# Altium schematic sheet 06-MAC.SchDoc
size 420 x 297 mm; Customer: 01910
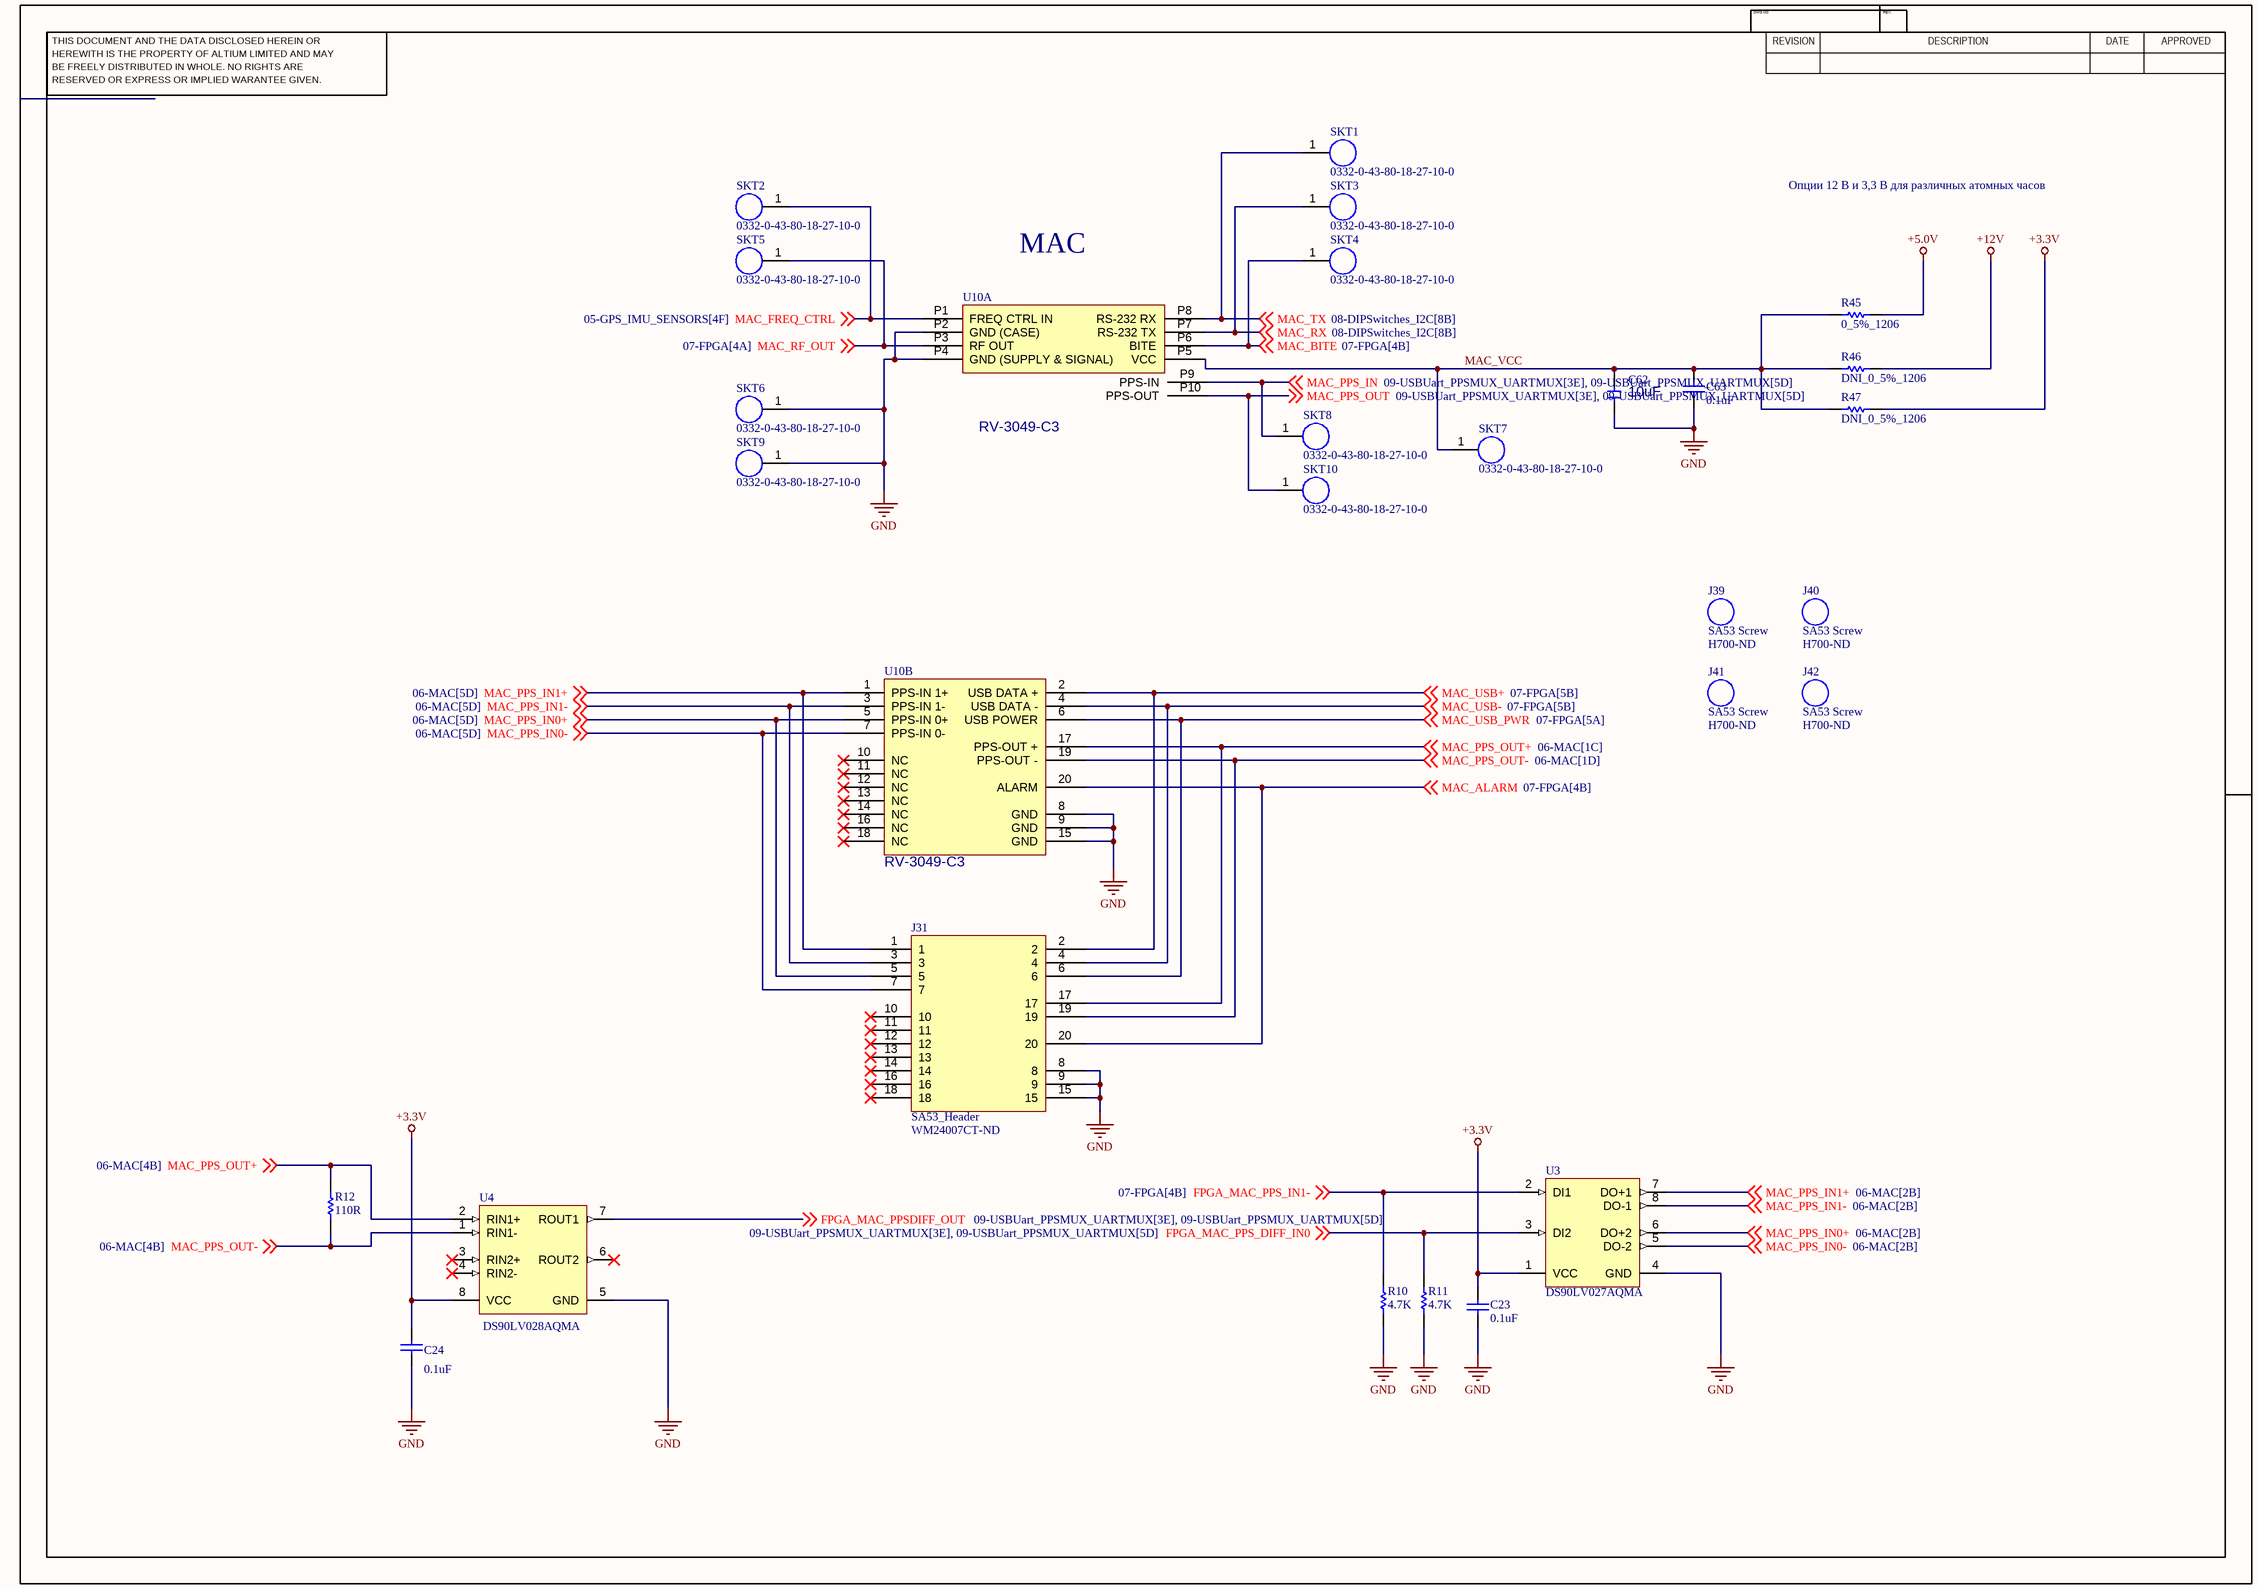
[diagram p0: 06-MAC.SchDoc]

## Parts
C23  0.1uF  [CAPC1608X87X45ML20T05]
C24  0.1uF  [CAPC1608X87X45ML20T05]
C62  value 10uF  [CAPC2012X14N]  (hidden comment: CAP_0805_10UF_25V)
C63  0.1uF  [CAPC1608X87X45ML20T05]
J31  SA53_Header  Supplier Part Number 1: WM24007CT-ND  [SA53_Header]
J39  SA53 Screw  Supplier Part Number 1: H700-ND
J40  SA53 Screw  Supplier Part Number 1: H700-ND
J41  SA53 Screw  Supplier Part Number 1: H700-ND
J42  SA53 Screw  Supplier Part Number 1: H700-ND
R10  4.7K  [RESC1608X55X25LL10T15]
R11  4.7K  [RESC1608X55X25LL10T15]
R12  110R  [RESC1609X50X30NL10T20]
R45  0_5%_1206  [RESC3116X65X50ML20T20]
R46  DNI_0_5%_1206  [RESC3116X65X50ML20T20]  (no BOM)
R47  DNI_0_5%_1206  [RESC3116X65X50ML20T20]  (no BOM)
SKT1  0332-0-43-80-18-27-10-0  [SolderSocket]
SKT2  0332-0-43-80-18-27-10-0  [SolderSocket]
SKT3  0332-0-43-80-18-27-10-0  [SolderSocket]
SKT4  0332-0-43-80-18-27-10-0  [SolderSocket]
SKT5  0332-0-43-80-18-27-10-0  [SolderSocket]
SKT6  0332-0-43-80-18-27-10-0  [SolderSocket]
SKT7  0332-0-43-80-18-27-10-0  [SolderSocket]
SKT8  0332-0-43-80-18-27-10-0  [SolderSocket]
SKT9  0332-0-43-80-18-27-10-0  [SolderSocket]
SKT10  0332-0-43-80-18-27-10-0  [SolderSocket]
U3  DS90LV027AQMA  [M08A_N]
U4  DS90LV028AQMA  [M08A_L]
U10  value RV-3049-C3  [SA53]  (hidden comment: MAC-SA5X)  (parts A,B of 2)

## Nets
+3.3V: C23.2 C24.1 R47.2 U3.1(VCC) U4.8(VCC)
+5.0V: R45.2
+12V: R46.2
GND: C23.1 C24.2 C62.2 C63.1 J31.8 J31.9 J31.15 R10.1 R11.1 SKT6.1 SKT9.1 U3.4(GND) U4.5(GND) U10.8(GND) U10.9(GND) U10.15(GND) U10.P2(GND_(CASE)) U10.P4(GND_(SUPPLY_&_SIGNAL))
FPGA_MAC_PPS_DIFF_IN0: R11.2 U3.3(DI2) ; off-sheet FPGA_MAC_PPS_DIFF_IN0
FPGA_MAC_PPS_IN1-: R10.2 U3.2(DI1) ; off-sheet FPGA_MAC_PPS_IN1-
FPGA_MAC_PPSDIFF_OUT: U4.7(ROUT1) ; off-sheet FPGA_MAC_PPSDIFF_OUT
MAC_ALARM: J31.20 U10.20(ALARM) ; off-sheet MAC_ALARM
MAC_BITE: SKT4.1 U10.P6(BITE) ; off-sheet MAC_BITE
MAC_FREQ_CTRL: SKT2.1 U10.P1(FREQ_CTRL_IN) ; off-sheet MAC_FREQ_CTRL
MAC_PPS_IN: SKT8.1 U10.P9(PPS-IN) ; off-sheet MAC_PPS_IN
MAC_PPS_IN0+: J31.5 U3.6(DO+2) U10.5(PPS-IN_0+) ; off-sheet MAC_PPS_IN0+
MAC_PPS_IN0-: J31.7 U3.5(DO-2) U10.7(PPS-IN_0-) ; off-sheet MAC_PPS_IN0-
MAC_PPS_IN1+: J31.1 U3.7(DO+1) U10.1(PPS-IN_1+) ; off-sheet MAC_PPS_IN1+
MAC_PPS_IN1-: J31.3 U3.8(DO-1) U10.3(PPS-IN_1-) ; off-sheet MAC_PPS_IN1-
MAC_PPS_OUT: SKT10.1 U10.P10(PPS-OUT) ; off-sheet MAC_PPS_OUT
MAC_PPS_OUT+: J31.17 R12.2 U4.2(RIN1+) U10.17(PPS-OUT_+) ; off-sheet MAC_PPS_OUT+
MAC_PPS_OUT-: J31.19 R12.1 U4.1(RIN1-) U10.19(PPS-OUT_-) ; off-sheet MAC_PPS_OUT-
MAC_RF_OUT: SKT5.1 U10.P3(RF_OUT) ; off-sheet MAC_RF_OUT
MAC_RX: SKT3.1 U10.P7(RS-232_TX) ; off-sheet MAC_RX
MAC_TX: SKT1.1 U10.P8(RS-232_RX) ; off-sheet MAC_TX
MAC_USB+: J31.2 U10.2(USB_DATA_+) ; off-sheet MAC_USB+
MAC_USB-: J31.4 U10.4(USB_DATA_-) ; off-sheet MAC_USB-
MAC_USB_PWR: J31.6 U10.6(USB_POWER) ; off-sheet MAC_USB_PWR
MAC_VCC: C62.1 C63.2 R45.1 R46.1 R47.1 SKT7.1 U10.P5(VCC)

Not connected (* = marked no-connect by the designer): J31 10* 11* 12* 13* 14* 16* 18*; U4 3(RIN2+)* 4(RIN2-)* 6(ROUT2)*; U10 10(NC)* 11(NC)* 12(NC)* 13(NC)* 14(NC)* 16(NC)* 18(NC)*

## Notes on the sheet
- Опции 12 В и 3,3 В для различных атомных часов
- MAC
- THIS DOCUMENT AND THE DATA DISCLOSED HEREIN OR
- HEREWITH IS THE PROPERTY OF ALTIUM LIMITED AND MAY
- DWG NO:
- REVISION
- REV:
- DESCRIPTION
- DATE
- APPROVED
- BE FREELY DISTRIBUTED IN WHOLE. NO RIGHTS ARE
- RESERVED OR EXPRESS OR IMPLIED WARANTEE GIVEN.

## Library data of the parts
C23 C24 C63 = CMP-2006-00003-1: C0603X104K5RACAUTO; Manufacturer: Kemet; Part Number: C0603X104K5RACAUTO
C62 = CAP_0805_10UF_25V: CAP, CER, 10.UF, 25V, 10%, X5R, 0805; MFG PART NUM: TMK212BBJ106KG-T; VALENTIUM PART NUM: <VALENTIUM>; MFG NAME: TAIYO YUDEN; MAXTEMP: 85C; MINTEMP: -55C; DESC: CAP, CER, 10.UF, 10V, 10%, X5R, 0805; MODIFY DATE: 10/23/2013; CATEGORY: CAP, CER; Date: 4/11/2006 3:37:28 PM; SHEETPART: *; P1: 10%; P2: 25V; P3: X5R; Size: 0805; Supplier 1: MOUSER; Supplier Part Number 1: 963-TMK212BBJ106KG-T
R10 R11 = CMP-2000-06942-1: Chip Resistor, 4.7 KOhm, +/- 1%, 0.1 W, -55 to 155 degC, 0603 (1608 Metric), RoHS, Tape and Reel RC0603FR-074K7L; Manufacturer: Yageo; Power Rating: 100mW; Temperature Coefficient: 100PPM/C; Resistance: 4.7kOhms; Voltage Rating: 50V; Package Reference: 0603; Series: RC; Datasheet Version: Rev. 7, 05/2017; Packaging: Reel; Termination Style: SMD/SMT; Datasheet URL: http://www.yageo.com/documents/recent/PYu-RC_Group_51_RoHS_L_7.pdf; Manufacturer URL: http://www.yageo.com/; Package Description: 2-Pin Surface Mount Device, Body 1.6 x 0.8 mm; Case Code - mm: 1608; Case Code - in: 0603; Mounting Technology: SurfaceMount; Operating Temperature Range: -55Cto+155C; Tolerance: 1%; Product: ThickFilmResistorsGeneralPurpose
R12 = CMP-2000-03854-1: Part Number: CRCW0603110RFKEA; Manufacturer: Vishay Dale
R45-R47 = CMP-2003-04873-1: Part Number: CRCW12060000Z0EAHP; Manufacturer: Vishay Dale
SKT1-SKT10 = 0332-0-43-80-18-27-10-0: Solder socket for pin headers
U3 = CMP-0058-01000-2: Automotive LVDS Dual Differential Driver, 8-pin Narrow SOIC; Manufacturer: National Semiconductor; PackageTopMarking: NSZXTT*90LV0*27AQM; CompType: Interface IC; PowerWise: N; DatasheetVersion: Oct-2008; PinCount: 8; RevisionNote: Component URLs added; Code_IPC: SOIC127P600-8; ComponentLink1URL: http://www.national.com/ds/DS/DS90LV027AQ.pdf; ComponentLink3Description: M08A Package Page; PackageDescription: SOIC Narrow, 4.9 x 3.9 x 1.45mm, 8 Lead, 1.27mm Pitch; ComponentLink2Description: DS90LV027AQ Web Page; ComponentLink2URL: http://www.national.com/pf/DS/DS90LV027AQ.html; RoHS: Y; Code_JEDEC: MS-012-AA; PackageReference: M08A; PackageVersion: revM, May-2009; ComponentLink1Description: DS90LV027AQ Datasheet; ComponentLink3URL: http://www.national.com/packaging/folders/m08a.html
U4 = CMP-0058-01010-2: Automotive LVDS Dual Differential Line Receiver, 8-pin Narrow SOIC; Manufacturer: National Semiconductor; PowerWise: N; PackageTopMarking: NSZXTT*90LV0*28AQM; CompType: Interface IC; DatasheetVersion: Oct-2008; PackageReference: M08A; RevisionNote: Component URLs added; Code_JEDEC: MS-012-AA; PackageVersion: revM, May-2009; ComponentLink1URL: http://www.national.com/ds/DS/DS90LV028AQ.pdf; PinCount: 8; ComponentLink3Description: M08A Package Page; ComponentLink1Description: DS90LV028AQ Datasheet; Code_IPC: SOIC127P600-8; RoHS: Y; ComponentLink2URL: http://www.national.com/pf/DS/DS90LV028AQ.html; PackageDescription: SOIC Narrow, 4.9 x 3.9 x 1.45mm, 8 Lead, 1.27mm Pitch; ComponentLink2Description: DS90LV028AQ Web Page; ComponentLink3URL: http://www.national.com/packaging/folders/m08a.html
U10 = MAC-SA5X: MOD, MAC, MAC-SA5X, ATOMIC CLOCK; VELENTIUM PART NUM: <V PART NUM>; MFG NAME: MICROCHIP; MAXTEMP: 85C; MINTEMP: -40C; OTHER: AEC-Q200; MODIFY DATE: 3/22/2006 1:36:44 PM; MFG PART NUM: MAC-SA5X; CATEGORY: MOD; P1: ATOMIC CLOCK; SHEETPART: *; DESC: MOD, MAC, MAC-SA5X, ATOMIC CLOCK
J31 = SA53_Header: Supplier 1: Digi-Key
J39-J42 = SA53 Screw: Supplier 1: Digi-Key